# Altium schematic sheet Sheet1.SchDoc
size A4
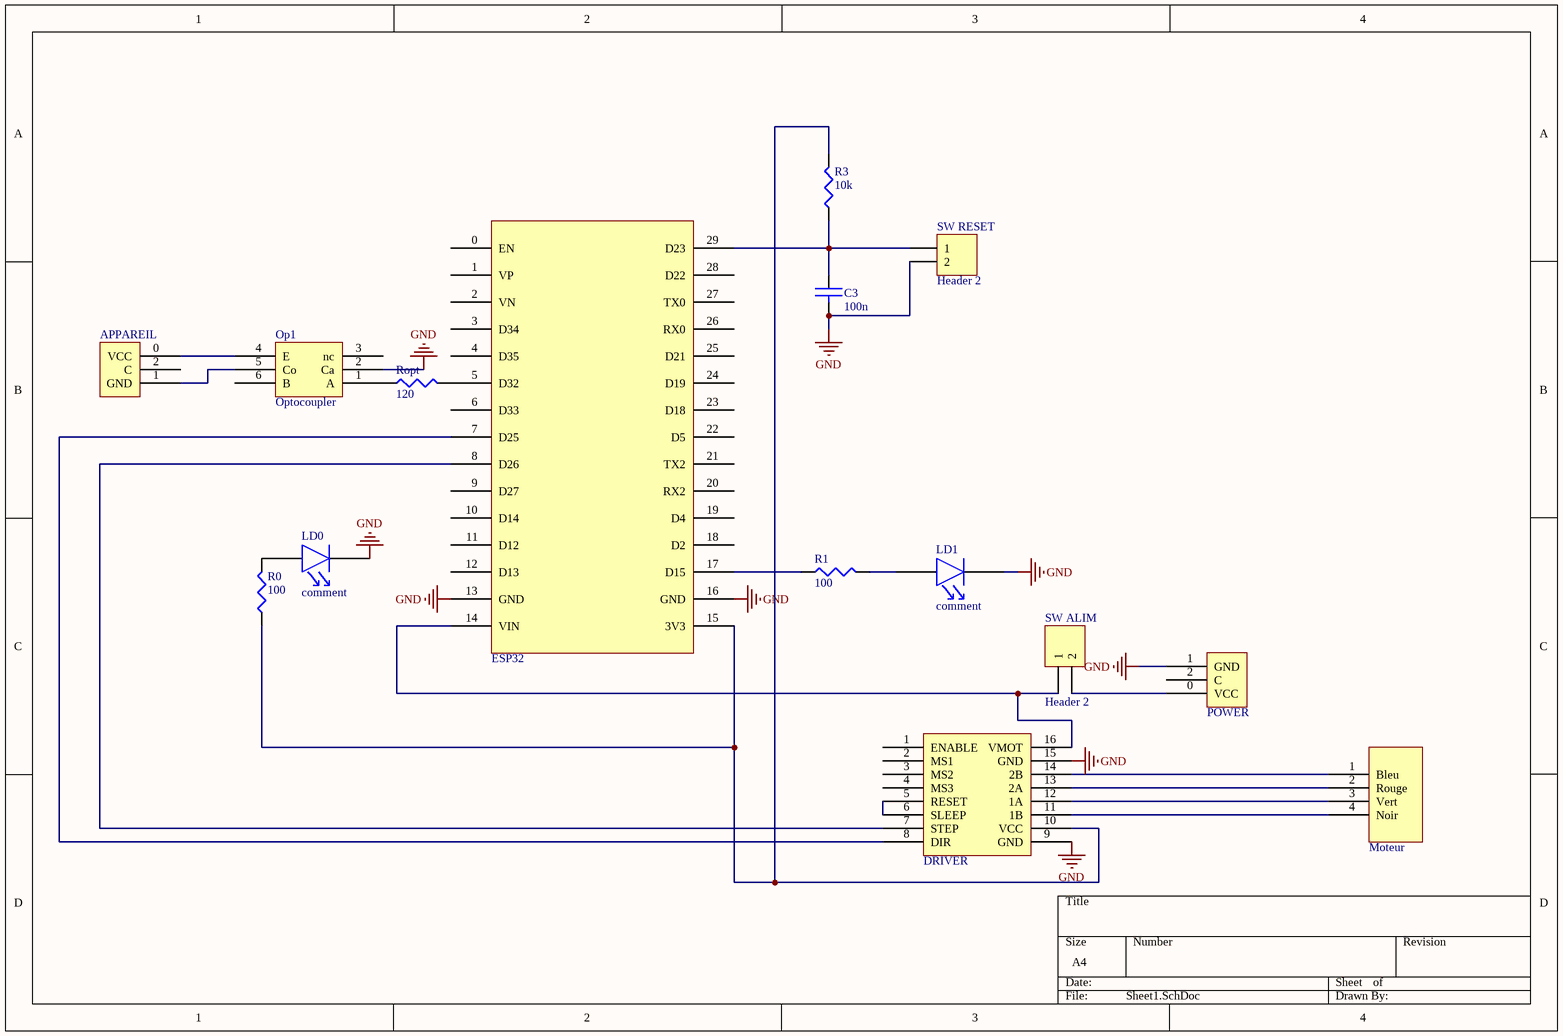
[diagram p0: Sheet1.SchDoc]

## Parts
APPAREIL  Connecteur Power  [Connecteur Power]  (value not drawn)
C3  value 100n  [RAD0.1]  (hidden comment: CAP)
DRIVER  Driver  [Driver]  (value not drawn)
ESP32  ESP32devKit  [ESP32]  (value not drawn)
LD0  comment  [LED5]
LD1  comment  [LED5]
Moteur  Moteur  [Moteur]  (value not drawn)
Op1  Optocoupler  [4N26]
POWER  Connecteur Power  [Connecteur Power]  (value not drawn)
R0  value 100  [AXIAL0.3]  (hidden comment: RES)
R1  value 100  [AXIAL0.3]  (hidden comment: RES)
R3  value 10k  [AXIAL0.4]  (hidden comment: RES)
Ropt  value 120  [AXIAL0.4]  (hidden comment: RES)
SW_ALIM  Header 2  [HDR1X2]
SW_RESET  Header 2  [HDR1X2]

## Nets
GND: C3.2 DRIVER.9(GND) DRIVER.15(GND) ESP32.13(GND) ESP32.16(GND) LD0.K LD1.K Op1.2(Ca) POWER.1(GND) SW_RESET.2
NetAPPAREIL_0: APPAREIL.0(VCC) Op1.4(E)
NetAPPAREIL_1: APPAREIL.1(GND) Op1.5(Co)
NetC3_1: C3.1 ESP32.29(D23) R3.1 SW_RESET.1
NetDRIVER_5: DRIVER.5(RESET) DRIVER.6(SLEEP)
NetDRIVER_7: DRIVER.7(STEP) ESP32.8(D26)
NetDRIVER_8: DRIVER.8(DIR) ESP32.7(D25)
NetDRIVER_10: DRIVER.10(VCC) ESP32.15(3V3) R0.1 R3.2
NetDRIVER_11: DRIVER.11(1B) Moteur.4(Noir)
NetDRIVER_12: DRIVER.12(1A) Moteur.3(Vert)
NetDRIVER_13: DRIVER.13(2A) Moteur.2(Rouge)
NetDRIVER_14: DRIVER.14(2B) Moteur.1(Bleu)
NetDRIVER_16: DRIVER.16(VMOT) ESP32.14(VIN) SW_ALIM.1
NetESP32_5: ESP32.5(D32) Ropt.2
NetESP32_17: ESP32.17(D15) R1.1
NetLD0_A: LD0.A R0.2
NetLD1_A: LD1.A R1.2
NetOp1_1: Op1.1(A) Ropt.1
NetPOWER_0: POWER.0(VCC) SW_ALIM.2

Not connected (* = marked no-connect by the designer): APPAREIL 2(C); DRIVER 1(ENABLE) 2(MS1) 3(MS2) 4(MS3); ESP32 0(EN) 1(VP) 2(VN) 3(D34) 4(D35) 6(D33) 9(D27) 10(D14) 11(D12) 12(D13) 18(D2) 19(D4) 20(RX2) 21(TX2) 22(D5) 23(D18) 24(D19) 25(D21) 26(RX0) 27(TX0) 28(D22); Op1 3(nc) 6(B); POWER 2(C)

## Library data of the parts
C3 = CAP: capacité non polarisée
DRIVER = Driver: Driver A4988
LD0 LD1 = LED: LED 5mm/3mm/CMS
R0 R1 R3 Ropt = RES: resistance
SW_ALIM SW_RESET = Header 2: Header, 2-Pin; LatestRevisionDate: 17-Jul-2002; LatestRevisionNote: Re-released for DXP Platform.; Publisher: Altium Limited